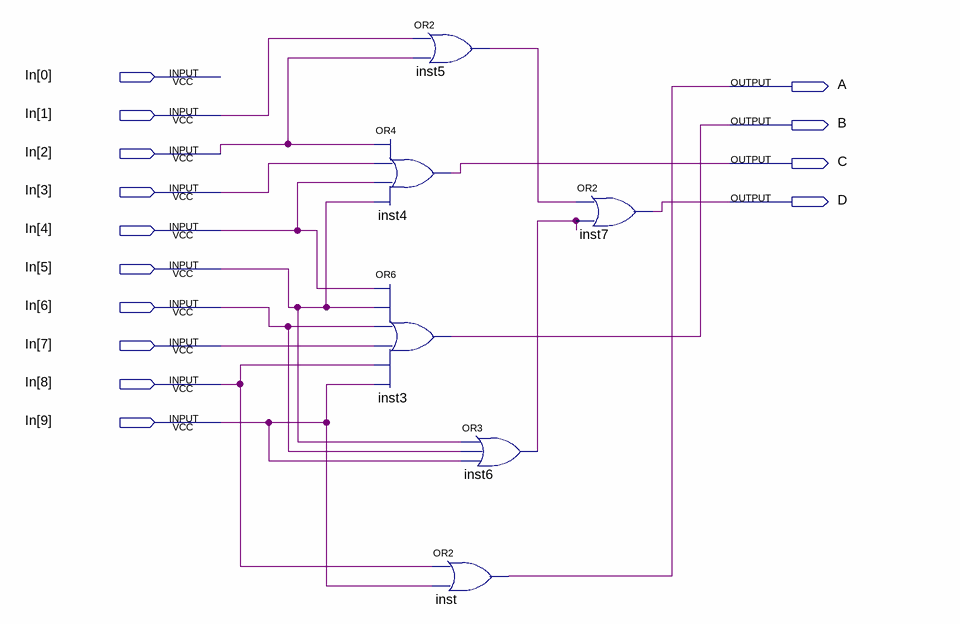
[diagram p0: schematic sheet]
// Quartus schematic lab51.bdf as structural Verilog: 6 symbols, 14 pins
module lab51 (
  input  [9:0] In,
  output A,
  output B,
  output C,
  output D
);

  wire inst5_out, inst6_out;

  or inst5 (inst5_out, In[1], In[2]);
  or inst4 (C, In[2], In[3], In[4], In[5]);
  or inst3 (B, In[4], In[5], In[6], In[7], In[8], In[9]);
  or inst (A, In[8], In[9]);
  or inst6 (inst6_out, In[5], In[6], In[9]);
  or inst7 (D, inst5_out, inst6_out);
endmodule
